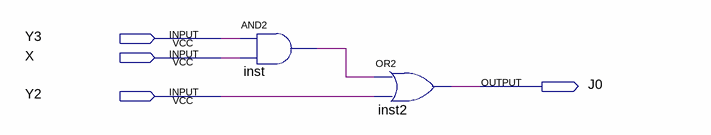
[diagram p0: schematic sheet]
// Quartus schematic J0.bdf as structural Verilog: 2 symbols, 4 pins
module J0 (
  input  Y3,
  input  X,
  input  Y2,
  output J0
);

  wire inst_out;

  and inst (inst_out, Y3, X);
  or inst2 (J0, inst_out, Y2);
endmodule
